# EAGLE design pH_mini_v30 (EAGLE 7.6.0)
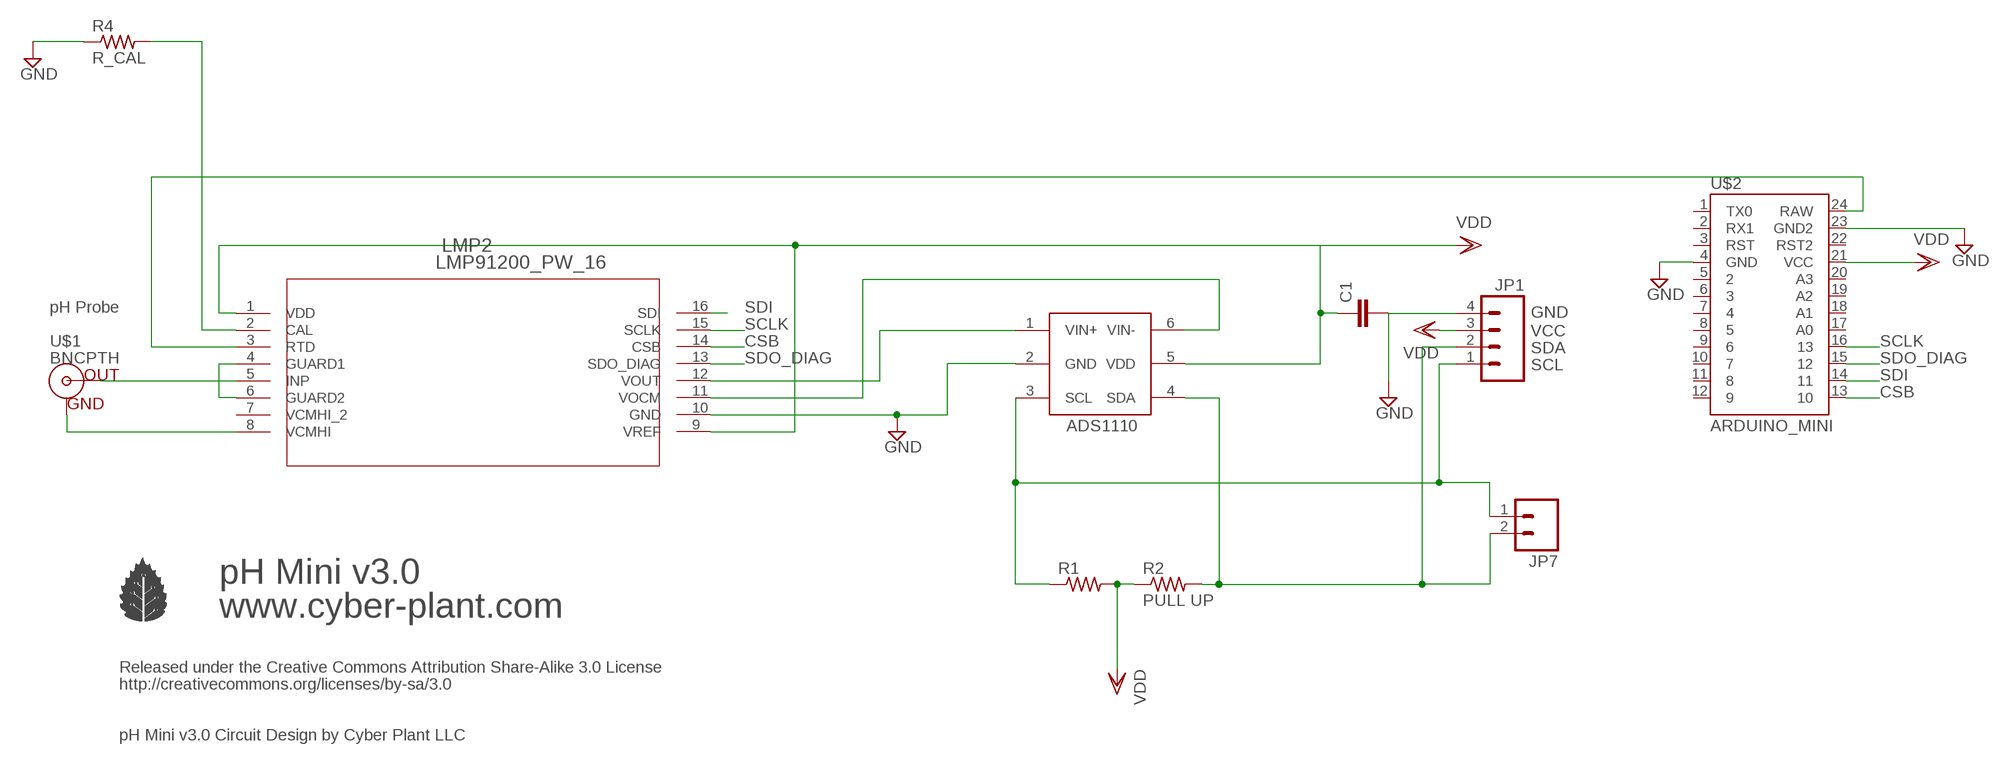
[diagram p0: schematic, sheet 1]

## Parts
C1  CAP1206  [1206]
IC1  ADS1110  [SOT-23-6]
JP1  M04PTH  [1X04]
JP7  M02PTH  [1X02]
LMP2  LMP91200_PW_16  [MTC16]
R1  R-US_0207/10  [0207/10]
R2  PULL UP  R-US_0207/10  [0207/10]
R4  R_CAL  R-US_0207/10  [0207/10]
U$1  BNCPTH  [BNC]
U$2  ARDUINO_MINI  [ARDUINO_MINI]

## Nets
CSB: LMP2.14(CSB) U$2.13
GND: C1.2 IC1.2(GND) JP1.4 LMP2.10(GND) R4.1 U$2.4(GND) U$2.23(GND2)
N$4: IC1.1(VIN+) LMP2.12(VOUT)
N$5: IC1.6(VIN-) LMP2.11(VOCM)
N$14: LMP2.3(RTD) U$2.24(RAW)
N$15: LMP2.8(VCMHI) U$1.GND
N$16: LMP2.5(INP) U$1.S(OUT)
N$17: LMP2.2(CAL) R4.2
N$18: LMP2.4(GUARD1) LMP2.6(GUARD2)
SCL: IC1.3(SCL) JP1.1 JP7.1 R1.1
SCLK: LMP2.15(SCLK) U$2.16
SDA: IC1.4(SDA) JP1.2 JP7.2 R2.2
SDI: LMP2.16(SDI) U$2.14
SDO_DIAG: LMP2.13(SDO_DIAG) U$2.15
VDD: C1.1 IC1.5(VDD) JP1.3 LMP2.1(VDD) LMP2.9(VREF) R1.2 R2.1 U$2.21(VCC)
Unconnected: LMP2.7(VCMHI_2) U$2.1(TX0) U$2.2(RX1) U$2.3(RST) U$2.5 U$2.6 U$2.7 U$2.8 U$2.9 U$2.10 U$2.11 U$2.12 U$2.17(A0) U$2.18(A1) U$2.19(A2) U$2.20(A3) U$2.22(RST2)

## Notes on the sheet
- pH Probe
- GND
- VCC
- SDA
- SCL
- pH Mini v3.0
- www.cyber-plant.com
- Released under the Creative Commons Attribution Share-Alike 3.0 License
- http://creativecommons.org/licenses/by-sa/3.0
- pH Mini v3.0 Circuit Design by Cyber Plant LLC

## Library data of the parts
C1 = SparkFun:CAP: Capacitor Standard 0603 ceramic capacitor, and 0.1" leaded capacitor.
IC1 = ads11xx:ADS1110: Analog/Digital conventer i2c Bus max: 2.048v
JP1 = Arduinominimi:M04: Header 4 Standard 4-pin 0.1" header. Use with straight break away headers (SKU : PRT-00116), right angle break away headers (PRT-00553), swiss pins (PRT-00743), machine pins (PRT-00117), and female headers (PRT-00115). Molex polarized connector foot print use with SKU : PRT-08231 with associated crimp pins and housings. 1MM SMD Version SKU: PRT-10208
JP7 = Arduinominimi:M02: Header 2 Standard 2-pin 0.1" header. Use with straight break away headers (SKU : PRT-00116), right angle break away headers (PRT-00553), swiss pins (PRT-00743), machine pins (PRT-00117), and female headers (PRT-00115). Molex polarized connector foot print use with SKU : PRT-08233 with associated crimp pins and housings.
LMP2 = LMP91200:LMP91200_PW_16; BASEPN: LMP91200; DATASHEETURL: http://www.ti.com/lit/ds/symlink/lmp91200.pdf; DESCRIPTION: Configurable AFE for Low-Power Chemical Sensing Applications; MANUFACTURER: Texas Instruments; MANUFACTURER_PART_NUMBER: lmp91200_pw_16; NSC_PACKAGEREFERENCE: MTC16; VENDOR: Texas Instruments
R1 R2 R4 = resistor:R-US_: RESISTOR, American symbol
U$1 = BNCnoContur:BNC: BNC Connector, Mouser Part# 5227161
U$2 = Arduinominimi:ARDUINO_MINI

## Board
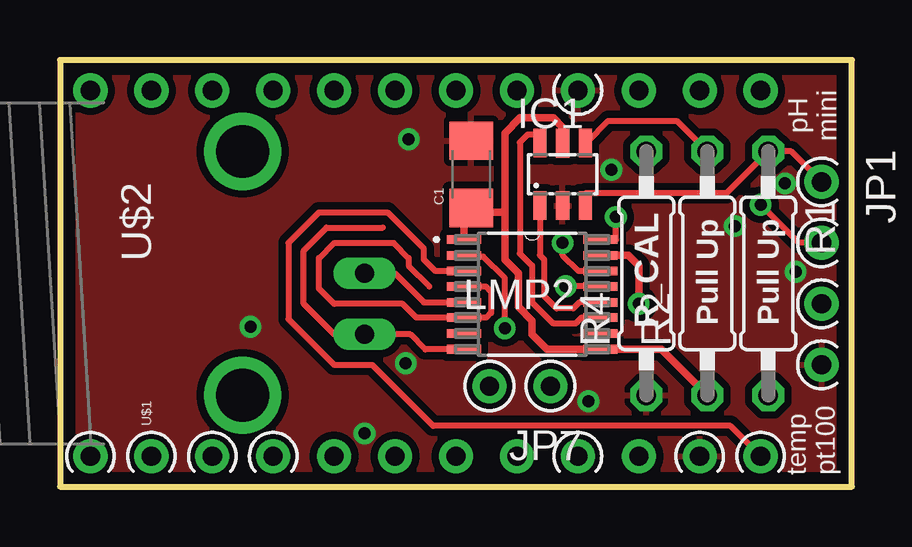
[diagram p1: board, top side]
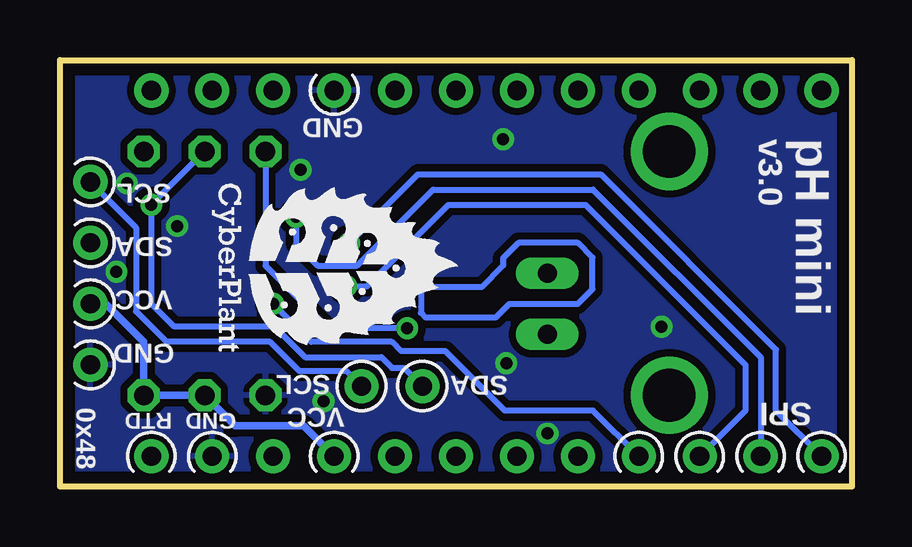
[diagram p2: board, bottom side, seen from below]

Size 33.02 x 17.78 mm. Coordinates in mm from the lower left corner, seen from the top.
Outline: 0,17.78 0,0 33.02,0 33.02,17.78 0,17.78
Copper layers (1*16): Top 0.035mm / dielectric 1.5mm / Bottom 0.035mm
Design rules "default *": minimum track width 10mil, minimum drill 12mil, track to track 10mil, track to pad 10mil, pad to pad 10mil, via to via 10mil, smd to smd 10mil, copper to edge 0.5mm, drill to drill 12mil, minimum pad ring 10mil, minimum via ring 8mil, stop-mask expansion 4mil, vias tented up to drill 20mil, thermal gap 10mil

### Footprints (pad centres in the part's own frame; a part is rotated, then mirrored left to right if it is on the bottom)
1206 = smd 1.6 x 1.8: 1 -1.4,0; 2 1.4,0
SOT-23-6 = smd 0.55 x 1.2: 1 -0.95,-1.3; 2 0,-1.3; 3 0.95,-1.3; 4 0.95,1.3; 5 0,1.3; 6 -0.95,1.3
1X04 = drill 0.8 pad 1.422: 1 0,0; 2 2.54,0; 3 5.08,0; 4 7.62,0
1X02 = drill 0.8 pad 1.422: 1 0,0; 2 2.54,0
MTC16 = smd 1.422 x 0.356: 1 -2.845,2.286; 2 -2.845,1.626; 3 -2.845,0.965; 4 -2.845,0.33; 5 -2.845,-0.33; 6 -2.845,-0.965; 7 -2.845,-1.626; 8 -2.845,-2.286; 9 2.845,-2.286; 10 2.845,-1.626; 11 2.845,-0.965; 12 2.845,-0.33; 13 2.845,0.33; 14 2.845,0.965; 15 2.845,1.626; 16 2.845,2.286
0207/10 = drill 0.813 octagon: 1 -5.08,0; 2 5.08,0
BNC = drill 2.2: 3 -5.08,5.08; 4 5.08,5.08 | drill 0.8 long: GND -2.54,0; S 0,0
ARDUINO_MINI = drill 0.8 pad 1.422: 1 -7.62,12.7; 2 -7.62,10.16; 3 -7.62,7.62; 4 -7.62,5.08; 5 -7.62,2.54; 6 -7.62,0; 7 -7.62,-2.54; 8 -7.62,-5.08; 9 -7.62,-7.62; 10 -7.62,-10.16; 11 -7.62,-12.7; 12 -7.62,-15.24; 13 7.62,-15.24; 14 7.62,-12.7; 15 7.62,-10.16; 16 7.62,-7.62; 17 7.62,-5.08; 18 7.62,-2.54; 19 7.62,0; 20 7.62,2.54; 21 7.62,5.08; 22 7.62,7.62; 23 7.62,10.16; 24 7.62,12.7

### Placement (x,y rotation side)
C1  17.14,13.02 90 top
IC1  20.96,13.02 0 top
JP1  31.75,12.7 270 top
JP7  20.45,4.19 180 top
LMP2  19.68,8.01 0 top
R1  29.53,8.89 270 top
R2  26.99,8.89 90 top
R4  24.45,8.89 90 top
U$1  12.7,8.89 90 top
U$2  16.51,8.89 270 top

### Tracks (layer width: path | path; a pad name or v marks a point on that pad's centre or on a via)
CSB  (via drill 0.5)
  Top 0.254: v20.96,10.16 20.96,9.65 21.63,8.98 LMP2.14
  Bottom 0.254: U$2.13 3.18,3.18 3.18,5.71 10.48,13.02 18.1,13.02 v20.96,10.16
GND  (via drill 0.5)
  other vias: 7.94,6.67 12.7,2.22 22.99,13.21 14.54,14.48 14.41,5.14 30.67,8.95 30.23,12.64 22.03,3.56 28.13,10.86
  pour Top (isolate 0.305): 0,17.78 33.02,17.78 33.02,0 0,0
  pour Bottom (isolate 0.305): 0,17.78 33.02,17.78 33.02,0 0,0
N$4
  Top 0.254: IC1.1 20,9.65 20.19,9.46 20.19,7.94 20.7,7.43 21.4,7.43 21.65,7.68 LMP2.12
N$5
  Top 0.254: 20,14 IC1.6 | IC1.6 | IC1.6 20,14.67 19.49,14.67 19.18,14.35 19.18,9.72 19.68,9.21 19.68,7.68 20.57,6.79 21.5,6.79 21.75,7.05 LMP2.11
N$10
  Bottom 0.254: 14.29,7.62 11.43,7.62 10.82,8.23 10.82,9.55 11.43,10.16 13.91,10.16 14.54,9.53 14.54,9.21 15.43,8.32 17.78,8.32 17.97,8.13 17.97,7.24 17.78,7.05 14.86,7.05 14.29,7.62
N$14
  Top 0.254: U$2.24 27.94,2.54 15.56,2.54 13.02,5.08 11.43,5.08 9.52,6.99 9.52,10.16 10.79,11.43 13.65,11.43 15.18,9.91 15.18,9.46 15.66,8.98 LMP2.3
N$15
  Top 0.254: U$1.GND 12.83,6.35 | U$1.GND 14.61,6.35 15.23,5.73 LMP2.8 | U$1.GND 11.43,6.35 10.16,7.62 10.16,9.84 11.11,10.79 13.46,10.79
N$16
  Top 0.254: LMP2.5 15.18,7.68 13.97,8.89 U$1.S
N$17  (via drill 0.5)
  Top 0.254: v18.54,6.6 18.54,8.7 17.65,9.59 16.89,9.59 LMP2.2
  Bottom 0.254: R4.2 24.45,9.21 21.84,6.6 v18.54,6.6
N$18
  Top 0.254: 15.4,8.34 14.54,9.21 14.54,9.53 13.91,10.16 11.43,10.16 10.79,9.53 10.79,8.26 11.43,7.62 14.29,7.62 14.86,7.05 LMP2.6 17.78,7.05 17.97,7.24 17.97,8.13 17.75,8.34 LMP2.4
SCL
  Top 0.254: 21.9,12.06 IC1.3 21.9,12.22 21.91,12.22 27.78,12.22 R1.1 30.48,13.97 JP1.1
  Bottom 0.254: JP1.1 29.85,10.79 29.85,7.3 28.57,6.03 24.26,6.03 23.05,4.83 21.08,4.83 JP7.1
SCLK  (via drill 0.5)
  Top 0.305: v24.13,7.62 24.13,9.21 23.7,9.64 LMP2.15
  Bottom 0.254: U$2.16 10.79,3.18 14.48,3.18 16.95,5.65 18.8,5.65 19.18,6.03 22.54,6.03 v24.13,7.62
SDA  (via drill 0.5)
  Top 0.254: 21.9,14.6 IC1.4 21.94,14.32 22.86,15.24 25.72,15.24 R2.2 | JP1.2 30.8,10.16 v29.21,11.75
  Bottom 0.254: R2.2 v29.21,11.75 29.21,7.62 28.26,6.67 24.07,6.67 22.8,5.4 19.62,5.4 19.18,4.95 18.67,4.95 JP7.2
SDI  (via drill 0.5)
  Top 0.254: 23.18,10.88 v23.18,11.24 23.18,10.3 LMP2.16
  Bottom 0.254: U$2.14 3.81,5.4 10.79,12.38 17.46,12.38 20.64,9.21 22.29,9.21 23.18,10.1 v23.18,11.24
SDO_DIAG  (via drill 0.5)
  Top 0.254: LMP2.13 21.12,8.34 v21.08,8.35
  Bottom 0.254: U$2.15 4.45,3.18 4.45,5.08 11.11,11.75 16.83,11.75 20.22,8.35 v21.08,8.35
VDD
  Top 0.305: 18.54,11.43 18.54,14.73 19.18,15.37 20.57,15.37 20.96,14.99 IC1.5 | 18.54,11.43 18.54,9.46 19.11,8.89 19.11,7.49 19.68,6.92 19.68,6.35 20.31,5.73 LMP2.9 25.07,5.73 R2.1 | 18.54,11.43 17.28,11.43 | LMP2.1 16.84,11.31 C1.1
  Top 0.406: 17.14,11.75 C1.1 17.14,11.43 17.28,11.43
  Bottom 0.305: U$2.21 22.86,2.54 25.72,2.54 R2.1 R1.2 29.53,6.03 31.11,7.62 JP1.3

### Text on the board
tPlace: pH / mini | R_CAL | Pull Up | Pull Up | temp / pt100
bPlace: GND | v3.0 | SCL | pH mini | SDA | VCC | GND | SDA | SCL | SPI | VCC | GND | RTD | 0x48